# Altium project uChord Logic.PrjPcb
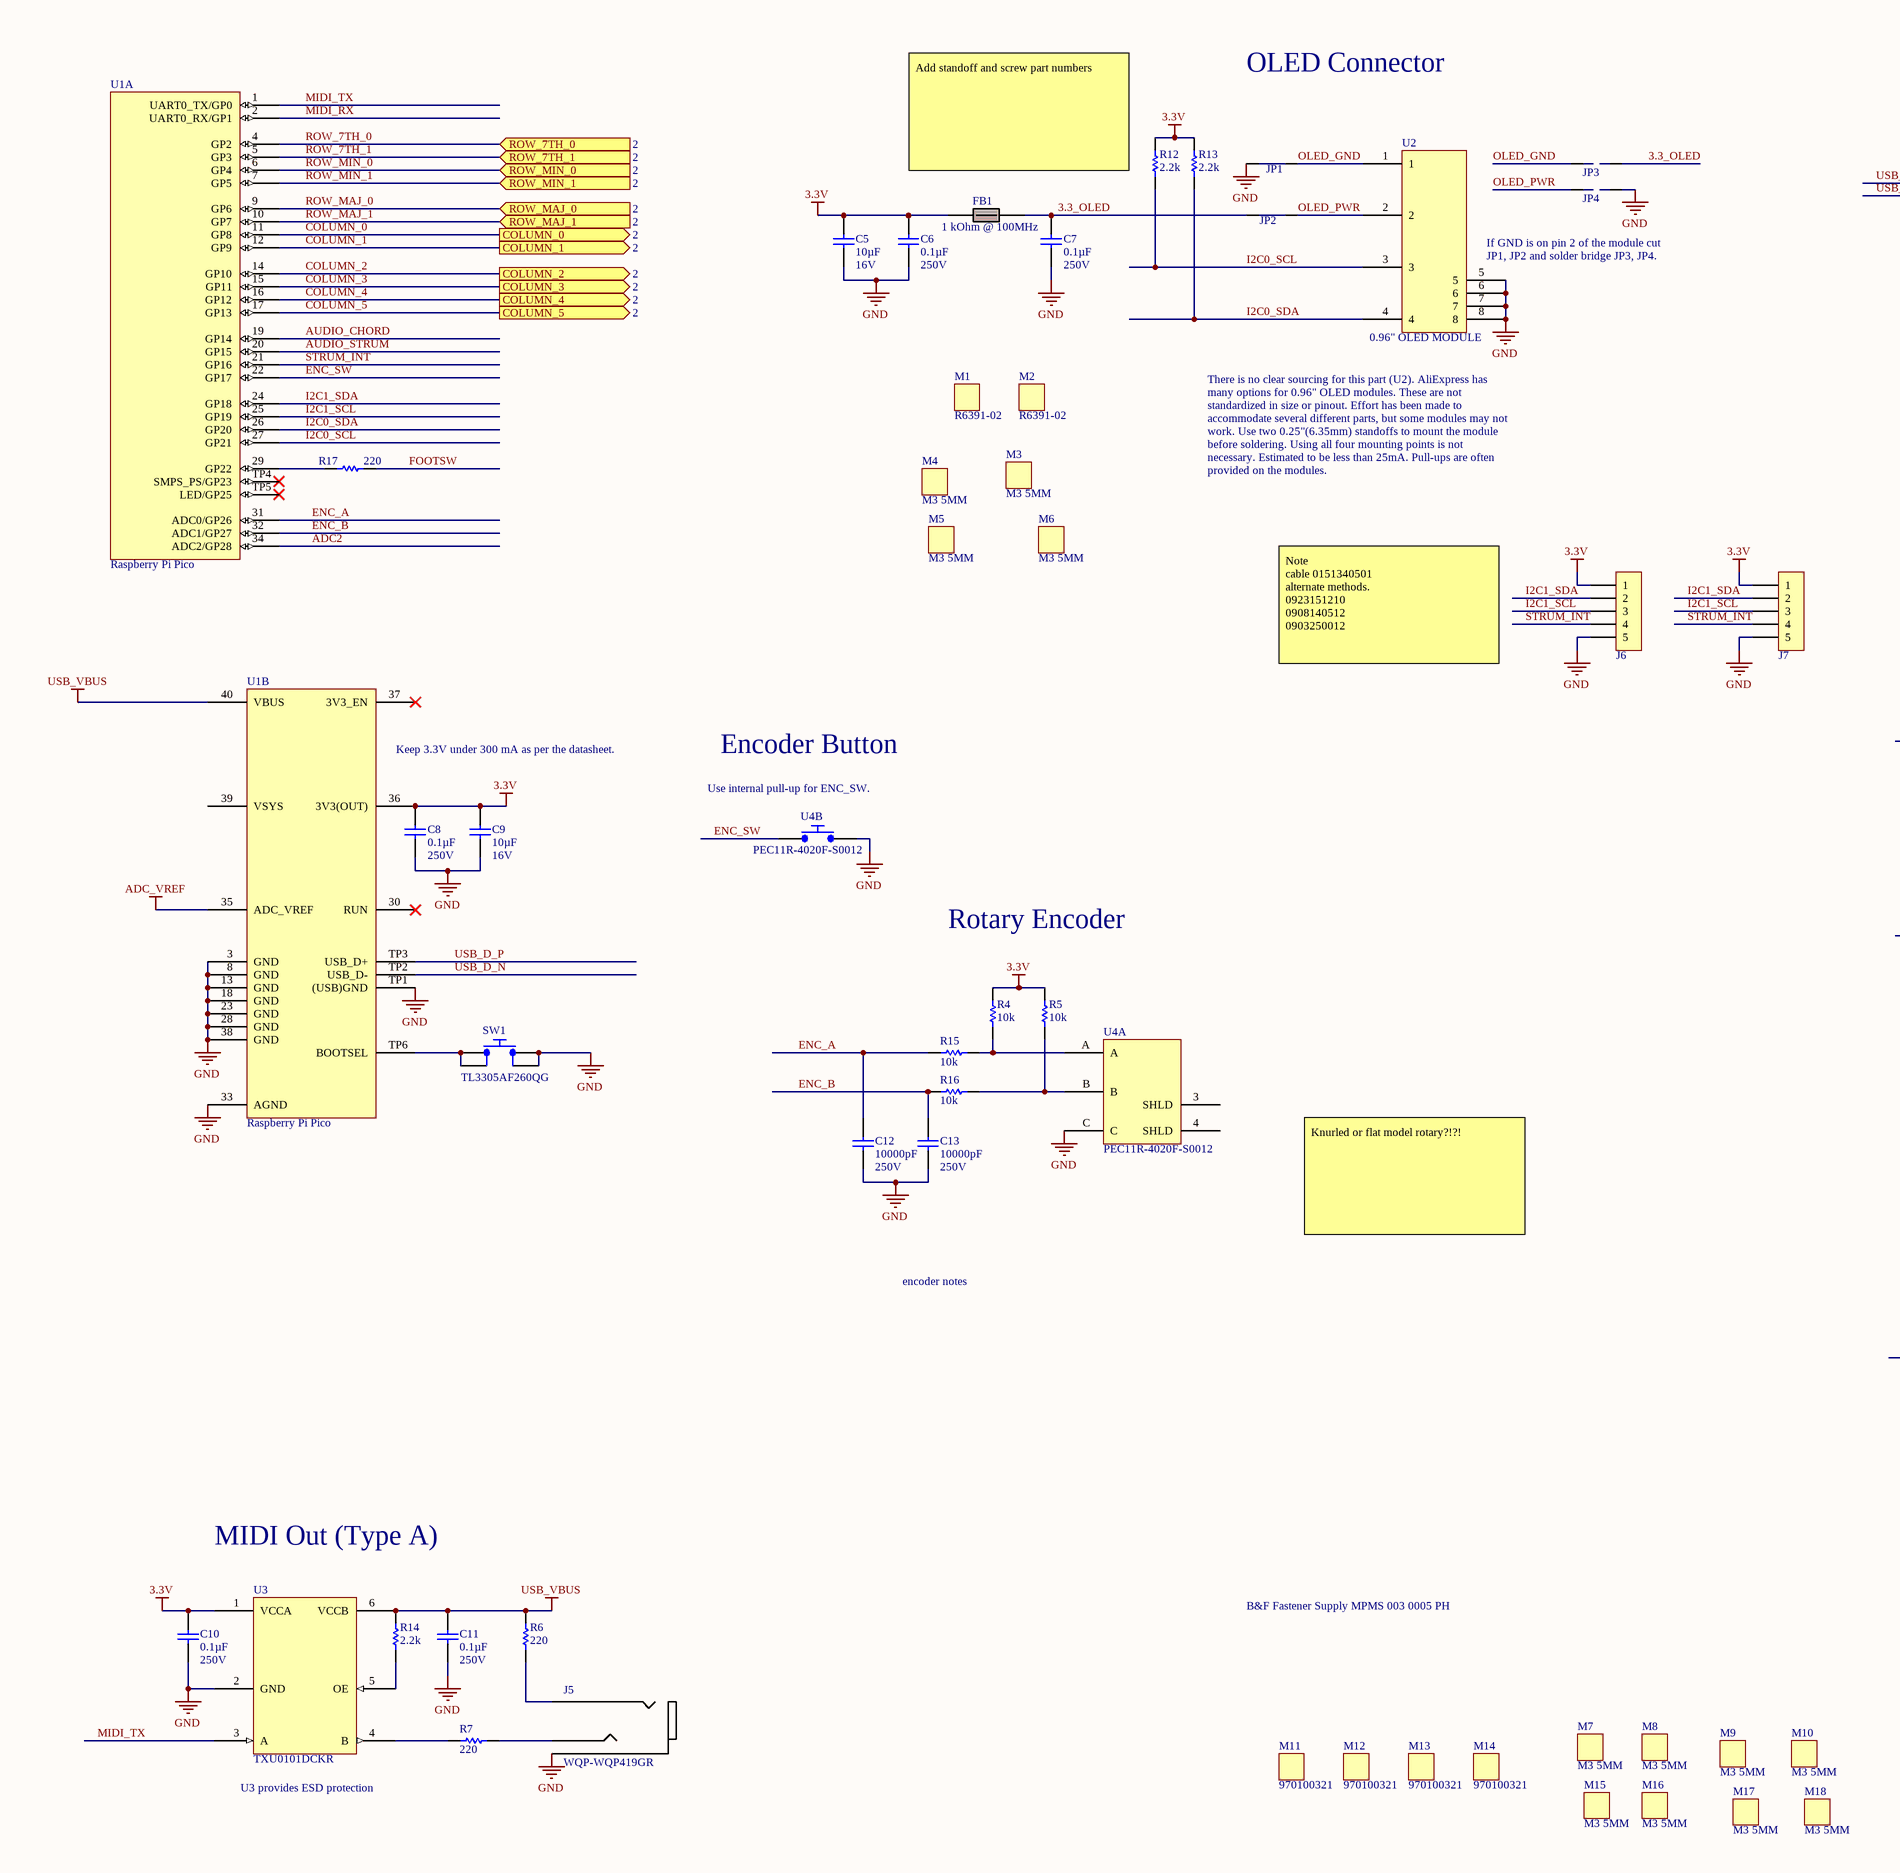
[diagram p0: Logic.SchDoc, left]
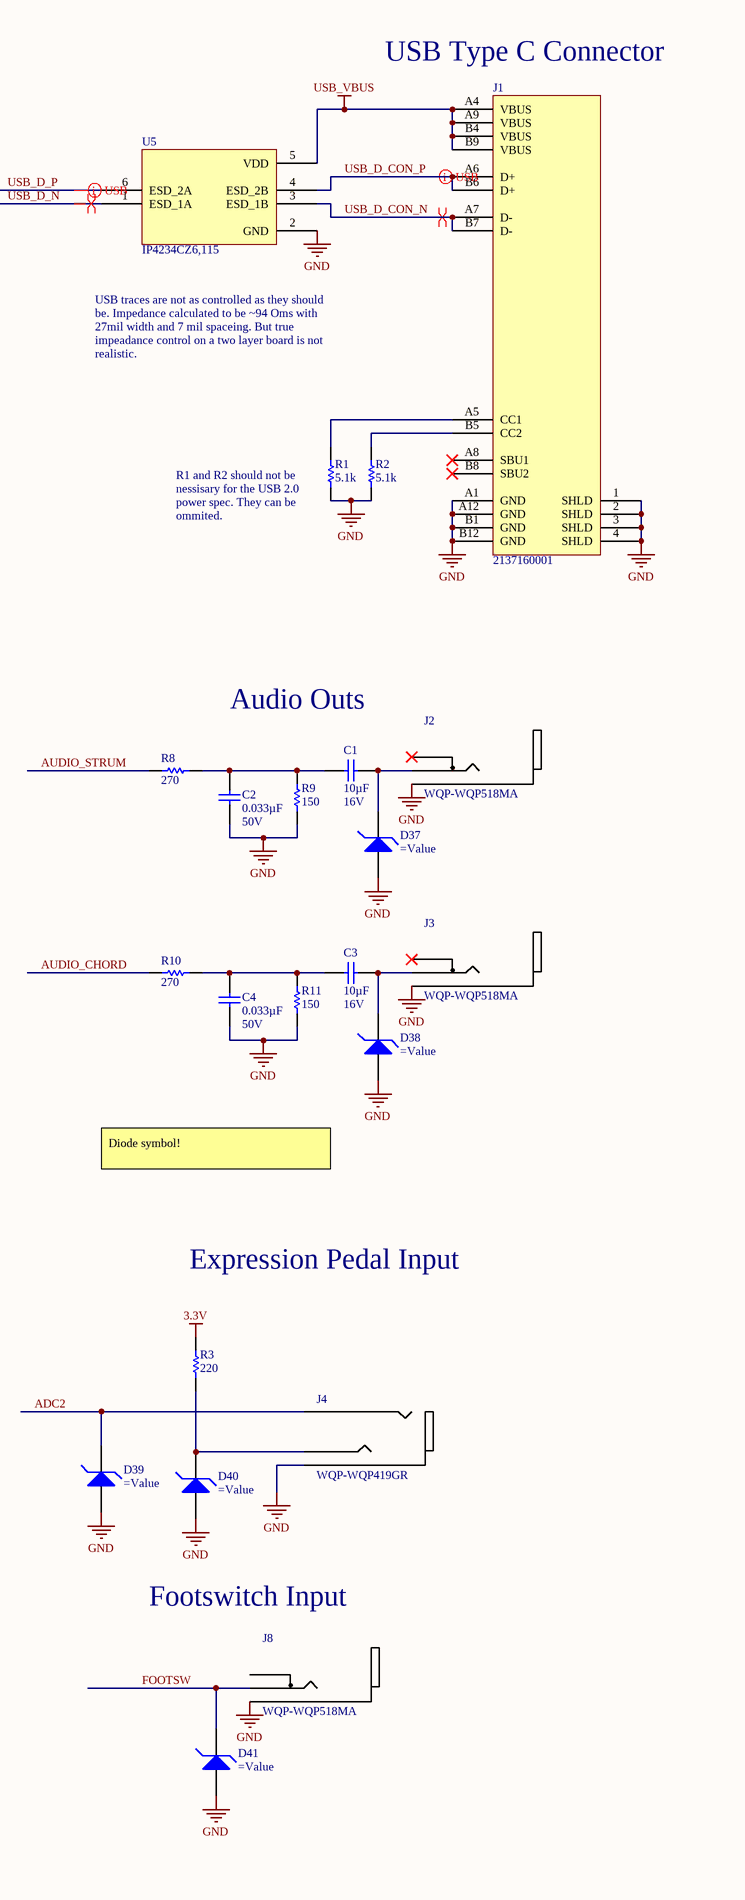
[diagram p1: Logic.SchDoc, right]
BOMRev: A; Codename: uChord Logic; HardRev: A; LeadEngineer: JCF
2 sheets, 144 parts. Net scope: flat (ports and power ports of the same name join across sheets).
Board file: uChord Logic.PcbDoc
Sheets:
  Logic.SchDoc
  Matrix.SchDoc

## Sheet Logic.SchDoc
size C; SheetNumber: 1; SheetTotal: 2

### Parts
C1  10µF  Voltage: 16V  [Chip0805]
C2  0.033µF  Voltage: 50V  [Chip0805]
C3  10µF  Voltage: 16V  [Chip0805]
C4  0.033µF  Voltage: 50V  [Chip0805]
C5  10µF  Voltage: 16V  [Chip0805]
C6  0.1µF  Voltage: 250V  [Chip0805]
C7  0.1µF  Voltage: 250V  [Chip0805]
C8  0.1µF  Voltage: 250V  [Chip0805]
C9  10µF  Voltage: 16V  [Chip0805]
C10  0.1µF  Voltage: 250V  [Chip0805]
C11  0.1µF  Voltage: 250V  [Chip0805]
C12  10000pF  Voltage: 250V  [Chip0805]
C13  10000pF  Voltage: 250V  [Chip0805]
D37  (no value)  [SOD-923]
D38  (no value)  [SOD-923]
D39  (no value)  [SOD-923]
D40  (no value)  [SOD-923]
D41  (no value)  [SOD-923]
FB1  Impedance @ Frequency: 1 kOhm @ 100MHz  [Chip0805]  (hidden comment: FERRITE)
J1  2137160001  [MOLEX_2137160001]
J2  WQP-WQP518MA  [PJ301M-12]
J3  WQP-WQP518MA  [PJ301M-12]
J4  WQP-WQP419GR  [PJ366ST]
J5  WQP-WQP419GR  [PJ366ST]
J6  0532610571  [MOLEX_0532610571]  (value not drawn)
J7  250010502  [HEADER_1x5_100mil_NP]  (value not drawn)
J8  WQP-WQP518MA  [PJ301M-12]
JP1  JUMMPER_NC_0805  [JUMMPER_NC_0805]  (value not drawn)  (no BOM)
JP2  JUMMPER_NC_0805  [JUMMPER_NC_0805]  (value not drawn)  (no BOM)
JP3  JUMMPER_NO_0805  [JUMMPER_NO_0805]  (value not drawn)  (no BOM)
JP4  JUMMPER_NO_0805  [JUMMPER_NO_0805]  (value not drawn)  (no BOM)
M1  R6391-02  (mechanical)
M2  R6391-02  (mechanical)
M3  M3 5MM  (mechanical)
M4  M3 5MM  (mechanical)
M5  M3 5MM  (mechanical)
M6  M3 5MM  (mechanical)
M7  M3 5MM  (mechanical)
M8  M3 5MM  (mechanical)
M9  M3 5MM  (mechanical)
M10  M3 5MM  (mechanical)
M11  970100321  (mechanical)
M12  970100321  (mechanical)
M13  970100321  (mechanical)
M14  970100321  (mechanical)
M15  M3 5MM  (mechanical)
M16  M3 5MM  (mechanical)
M17  M3 5MM  (mechanical)
M18  M3 5MM  (mechanical)
R1  5.1k  [Chip0603]
R2  5.1k  [Chip0603]
R3  220  [Chip0805]
R4  10k  [Chip0805]
R5  10k  [Chip0805]
R6  220  [Chip0805]
R7  220  [Chip0805]
R8  270  [Chip0805]
R9  150  [Chip0805]
R10  270  [Chip0805]
R11  150  [Chip0805]
R12  2.2k  [Chip0805]
R13  2.2k  [Chip0805]
R14  2.2k  [Chip0805]
R15  10k  [Chip0805]
R16  10k  [Chip0805]
R17  220  [Chip0805]
SW1  TL3305AF260QG  [E_SWITCH_TL3305]
U1  Raspberry Pi Pico  [RASPBERRY_PI_PICO]  (parts A,B of 2)
U2  0.96" OLED MODULE  [OLEDp96MOD_BOARD_MOUNT]
U3  TXU0101DCKR  [6-TSSOP]
U4  PEC11R-4020F-S0012  [BOURNS_PEC11R-4020F-S]  (parts A,B of 2)
U5  IP4234CZ6,115  [6-TSOP]

### Ports
COLUMN_0 (out, see 2), COLUMN_1 (out, see 2), COLUMN_2 (out, see 2), COLUMN_3 (out, see 2), COLUMN_4 (out, see 2), COLUMN_5 (out, see 2), ROW_7TH_0 (in, see 2), ROW_7TH_1 (in, see 2), ROW_MAJ_0 (in, see 2), ROW_MAJ_1 (in, see 2), ROW_MIN_0 (in, see 2), ROW_MIN_1 (in, see 2)

### Nets
3.3V: C5.2 C6.2 C8.2 C9.2 C10.2 FB1.1 J6.1 J7.1 R3.2 R4.2 R5.2 R12.2 R13.2 U1.36(3V3(OUT)) U3.1(VCCA)
ADC_VREF: U1.35(ADC_VREF)
GND: C2.1 C4.1 C5.1 C6.1 C7.1 C8.1 C9.1 C10.1 C11.1 C12.1 C13.1 D37.2(A) D38.2(A) D39.2(A) D40.2(A) D41.2(A) J1.1(SHLD) J1.2(SHLD) J1.3(SHLD) J1.4(SHLD) J1.A1(GND) J1.A12(GND) J1.B1(GND) J1.B12(GND) J2.1 J3.1 J4.1 J5.1 J6.5 J7.5 J8.1 JP1.1 JP4.1 R1.1 R2.1 R9.1 R11.1 SW1.3 SW1.4 U1.3(GND) U1.8(GND) U1.13(GND) U1.18(GND) U1.23(GND) U1.28(GND) U1.33(AGND) U1.38(GND) U1.TP1((USB)GND) U2.5 U2.6 U2.7 U2.8 U3.2(GND) U4.1 U4.C U5.2(GND)
USB_VBUS: C11.2 J1.A4(VBUS) J1.A9(VBUS) J1.B4(VBUS) J1.B9(VBUS) R6.2 R14.2 U1.40(VBUS) U3.6(VCCB) U5.5(VDD)
3.3_OLED: C7.2 FB1.2 JP2.1 JP3.1
ADC2: D39.1(K) J4.3 U1.34(ADC2/GP28)
AUDIO_CHORD: R10.1 U1.19(GP14)
AUDIO_STRUM: R8.1 U1.20(GP15)
COLUMN_0: U1.11(GP8) ; port COLUMN_0
COLUMN_1: U1.12(GP9) ; port COLUMN_1
COLUMN_2: U1.14(GP10) ; port COLUMN_2
COLUMN_3: U1.15(GP11) ; port COLUMN_3
COLUMN_4: U1.16(GP12) ; port COLUMN_4
COLUMN_5: U1.17(GP13) ; port COLUMN_5
ENC_A: C12.2 R15.2 U1.31(ADC0/GP26)
ENC_B: C13.2 R16.2 U1.32(ADC1/GP27)
ENC_SW: U1.22(GP17) U4.2
FOOTSW: D41.1(K) J8.2 R17.1
I2C0_SCL: R12.1 U1.27(GP21) U2.3
I2C0_SDA: R13.1 U1.26(GP20) U2.4
I2C1_SCL: J6.3 J7.3 U1.25(GP19)
I2C1_SDA: J6.2 J7.2 U1.24(GP18)
MIDI_RX: U1.2(UART0_RX/GP1)
MIDI_TX: U1.1(UART0_TX/GP0) U3.3(A)
OLED_GND: JP1.2 JP3.2 U2.1
OLED_PWR: JP2.2 JP4.2 U2.2
ROW_7TH_0: U1.4(GP2) ; port ROW_7TH_0
ROW_7TH_1: U1.5(GP3) ; port ROW_7TH_1
ROW_MAJ_0: U1.9(GP6) ; port ROW_MAJ_0
ROW_MAJ_1: U1.10(GP7) ; port ROW_MAJ_1
ROW_MIN_0: U1.6(GP4) ; port ROW_MIN_0
ROW_MIN_1: U1.7(GP5) ; port ROW_MIN_1
STRUM_INT: J6.4 J7.4 U1.21(GP16)
USB_D_CON_N: J1.A7(D-) J1.B7(D-) U5.3(ESD_1B)
USB_D_CON_P: J1.A6(D+) J1.B6(D+) U5.4(ESD_2B)
USB_D_N: U1.TP2(USB_D-) U5.1(ESD_1A)
USB_D_P: U1.TP3(USB_D+) U5.6(ESD_2A)
NetC1_1: C1.1 C2.2 R8.2 R9.2
NetC1_2: C1.2 D37.1(K) J2.2
NetC3_1: C3.1 C4.2 R10.2 R11.2
NetC3_2: C3.2 D38.1(K) J3.2
NetD40_1: D40.1(K) J4.2 R3.1
NetJ1_A5: J1.A5(CC1) R1.2
NetJ1_B5: J1.B5(CC2) R2.2
NetJ5_2: J5.2 R7.2
NetJ5_3: J5.3 R6.1
NetR4_1: R4.1 R15.1 U4.A
NetR5_1: R5.1 R16.1 U4.B
NetR7_1: R7.1 U3.4(B)
NetR14_1: R14.1 U3.5(OE)
NetR17_2: R17.2 U1.29(GP22)
NetSW1_1: SW1.1 SW1.2 U1.TP6(BOOTSEL)

Not connected (* = marked no-connect by the designer): J1 A8(SBU1)* B8(SBU2)*; J2 3*; J3 3*; J8 3; U1 30(RUN)* 37(3V3_EN)* 39(VSYS) TP4(SMPS_PS/GP23)* TP5(LED/GP25)*; U4 3(SHLD) 4(SHLD)

### Layout directives
differential pair; differential pair class DIFF90: USB_D_CON_N, USB_D_CON_P, USB_D_N, USB_D_P

### Notes on the sheet
- OLED Connector
- (near J1) USB Type C Connector
- (near R12) Add standoff and screw part numbers
- (near U2) If GND is on pin 2 of the module cut JP1, JP2 and solder bridge JP3, JP4.
- USB traces are not as controlled as they should be. Impedance calculated to be ~94 Oms with 27mil width and 7 mil spaceing. But true impeadance control on a two layer board is not realistic.
- There is no clear sourcing for this part (U2). AliExpress has many options for 0.96" OLED modules. These are not standardized in size or pinout. Effort has been made to accommodate several different parts, but some modules may not work. Use two 0.25"(6.35mm) standoffs to mount the module before soldering. Using all four mounting points is not necessary. Estimated to be less than 25mA. Pull-ups are often provided on the modules.
- (near R1) R1 and R2 should not be nessisary for the USB 2.0 power spec. They can be ommited.
- Note
  cable 0151340501
  alternate methods.
  0923151210
  0908140512
  0903250012
- Audio Outs
- (near U1) Keep 3.3V under 300 mA as per the datasheet.
- Encoder Button
- (near U4) Use internal pull-up for ENC_SW.
- Rotary Encoder
- Diode symbol!
- Knurled or flat model rotary?!?!
- Expression Pedal Input
- encoder notes
- MIDI Out (Type A)
- Footswitch Input
- B&F Fastener Supply MPMS 003 0005 PH
- U3 provides ESD protection
- Title:
- This work is licensed under a Creative Commons Attribution 4.0 International License. Derivative works should remove all Sophistry branding and ‘é’ watermark.
- Date:
- Engineer:
- Revision:
- Codename:
- Time:
- Variant:
- Sheet
- of

### Library data of the parts
C1 C3 C5 C9 = C2012X5R1C106K125AC: CAP CER 10UF 16V 10% X5R 0805; Manufacturer: TDK Corporation; PartNumber: C2012X5R1C106K125AC; HelpURL: http://product.tdk.com/capacitor/mlcc/en/documents/mlcc_commercial_general_en.pdf; Supplier 1: Digi-Key; Supplier Part Number 1: 445-7646-1-ND; Supplier 2: Mouser; Manufacturer Part Number: C2012X5R1C106K125AC; Series: C; Capacitance: 10µF; Tolerance: ±10%; Temperature Coefficient: X5R; Mounting Type: Surface Mount, MLCC; Operating Temperature: -55°C ~ 85°C; Applications: General Purpose; Ratings: -; Package / Case: 0805 (2012 Metric); Size / Dimension: 0.079" L x 0.049" W (2.00mm x 1.25mm); Height - Seated (Max): -; Thickness (Max): 0.057" (1.45mm); Lead Spacing: -; Features: -; Lead Style: -
C2 C4 = C2012C0G1H333J125AA: CAP CER 0.033UF 50V 5% NP0 0805; Manufacturer: TDK Corporation; Temperature Coefficient: C0G, NP0; PartNumber: C2012C0G1H333J125AA; HelpURL: http://product.tdk.com/capacitor/mlcc/en/documents/mlcc_commercial_general_en.pdf; Supplier 1: Digi-Key; Supplier Part Number 1: 445-7523-1-ND; Supplier 2: Mouser; Manufacturer Part Number: C2012C0G1H333J125AA; Series: C; Capacitance: 0.033µF; Tolerance: ±5%; Mounting Type: Surface Mount, MLCC; Operating Temperature: -55°C ~ 125°C; Applications: General Purpose; Ratings: -; Package / Case: 0805 (2012 Metric); Size / Dimension: 0.079" L x 0.049" W (2.00mm x 1.25mm); Height - Seated (Max): -; Thickness (Max): 0.057" (1.45mm); Lead Spacing: -; Features: -; Lead Style: -
C6-C8 C10 C11 = C2012X7T2E104K125AA: CAP CER 0.1UF 250V 10% X7T 0805; Manufacturer: TDK Corporation; PartNumber: C2012X7T2E104K125AA; HelpURL: http://product.tdk.com/capacitor/mlcc/en/documents/mlcc_commercial_midvoltage_en.pdf; Supplier 1: Digi-Key; Supplier Part Number 1: 445-7749-1-ND; Supplier 2: Mouser; Manufacturer Part Number: C2012X7T2E104K125AA; Series: C; Capacitance: 0.1µF; Tolerance: ±10%; Temperature Coefficient: X7T; Mounting Type: Surface Mount, MLCC; Operating Temperature: -55°C ~ 125°C; Applications: General Purpose; Ratings: -; Package / Case: 0805 (2012 Metric); Size / Dimension: 0.079" L x 0.049" W (2.00mm x 1.25mm); Height - Seated (Max): -; Thickness (Max): 0.057" (1.45mm); Lead Spacing: -; Features: -; Lead Style: -
C12 C13 = C2012X7R2E103M125AE: CAP CER 10000PF 250V X7R 0805; Manufacturer: TDK Corporation; Tolerance: ±20%; PartNumber: C2012X7R2E103M125AE; HelpURL: http://product.tdk.com/capacitor/mlcc/en/documents/mlcc_commercial_soft_en.pdf; Supplier 1: Digi-Key; Supplier Part Number 1: 445-6805-1-ND; Supplier 2: Mouser; Manufacturer Part Number: C2012X7R2E103M125AE; Series: C; Capacitance: 10000pF; Temperature Coefficient: X7R; Mounting Type: Surface Mount, MLCC; Operating Temperature: -55°C ~ 125°C; Applications: Boardflex Sensitive; Ratings: -; Package / Case: 0805 (2012 Metric); Size / Dimension: 0.079" L x 0.049" W (2.00mm x 1.25mm); Height - Seated (Max): -; Thickness (Max): 0.057" (1.45mm); Lead Spacing: -; Features: Soft Termination; Lead Style: -
D37-D41 = SZESD9X3.3ST5G: TVS DIODE 3.3VWM 10.4VC SOD923; Manufacturer: onsemi; PartNumber: SZESD9X3.3ST5G; Supplier 1: Digi-Key; Supplier 2: Mouser; Supplier Part Number 2: 863-SZESD9X3.3ST5G; HelpURL: https://www.onsemi.com/pdf/datasheet/esd9x3.3st5g-d.pdf; Supplier Part Number 1: SZESD9X3.3ST5GOSCT-ND; Manufacturer Part Number: SZESD9X3.3ST5G
FB1 = 74279205: FERRITE BEAD 1000 OHM .20A 0805; Manufacturer: Wurth Electronics Inc; Current Rating: 200mA; DC Resistance (DCR): 450 mOhm Max; Filter Type: Differential Mode - Single; PartNumber: 74279205; HelpURL: http://katalog.we-online.de/pbs/datasheet/74279205.pdf; Supplier 1: Digi-Key; Supplier Part Number 1: 732-1606-1-ND; Manufacturer Part Number: 74279205; Series: WE-CBF; Package / Case: 0805 (2012 Metric); Mounting Type: Surface Mount; Height (Max): 0.043" (1.10mm); Size / Dimension: 0.079" L x 0.047" W (2.00mm x 1.20mm)
J1 = 2137160001: CONN RCPT USB2.0 TYPE C 24POS RA; Manufacturer: Molex, LLC; PartNumber: 2137160001; Supplier 1: Digi-Key; Supplier 2: Mouser; Supplier Part Number 2: 538-213716-0001; HelpURL: https://www.molex.com/pdm_docs/sd/2137160001_sd.pdf; Supplier Part Number 1: 900-2137160001CT-ND; Manufacturer Part Number: 2137160001
J2 J3 J8 = WQP-WQP518MA: CONN 3.5mm VIRTICAL MONO w/ NORMAL; Manufacturer: QingPu; Connector Type: Phone Jack; Gender: Female; PartNumber: WQP-WQP518MA; HelpURL: http://www.qingpu-electronics.com/en/products/WQP-PJ398SM-362.html; Supplier 1: QingPu; Supplier Part Number 1: WQP-WQP518MA; Manufacturer Part Number: WQP-WQP518MA; Signal Lines: Mono
J4 J5 = WQP-WQP419GR: CONN 3.5mm VIRTICAL STEREO; Manufacturer: QingPu; Connector Type: Phone Jack; Gender: Female; PartNumber: WQP-WQP419GR; HelpURL: http://www.qingpu-electronics.com/en/products/WQP-PJ366ST-364.html; Supplier 1: QingPu; Supplier Part Number 1: WQP-WQP419GR; Manufacturer Part Number: WQP-WQP419GR; Signal Lines: Stereo
J6 = 0532610571: CONN HEADER SMD R/A 5POS 1.25MM; Manufacturer Part Number: WM7623CT-ND; Manufacturer: Molex; PartNumber: 0532610571; Supplier 1: Digi-Key; Supplier 2: Mouser; HelpURL: https://www.molex.com/pdm_docs/sd/532610571_sd.pdf
J7 = 250010502: CABLE 5POS .100 JUMPER 2 INCHES; Manufacturer: Molex Inc; Cable Type: Ribbon; Number of Conductors: 5; Pitch: 0.100" (2.54mm); PartNumber: 250010502; Datasheets: http://www.molex.com/pdm_docs/sd/250010502_sd.pdf; Supplier 1: Digi-Key; Supplier Part Number 1: WM05-02A-ND; Supplier 2: Mouser; Supplier Part Number 2: 538-25001-0502; Manufacturer Part Number: 250010502; Series: 25001; Length: 2.00" (50.80mm); Length - Exposed Ends: 0.125" (3.18mm); Termination Style: Completely Exposed Wires on Both Sides with Protective Tab
M1 M2 = R6391-02: HEX STANDOFF M3X0.5 BRASS 1/4"; Manufacturer: Harwin Inc.; HelpURL: https://cdn.harwin.com/pdfs/R6390-R6397.pdf; Supplier 1: Digi-Key; Supplier Part Number 1: R6391-02-ND; Supplier 2: Mouser; Supplier Part Number 2: 855-R6391-02; PartNumber: R6391-02; Manufacturer Part Number: R6391-02
M3-M10 M15-M18 = M3 5MM: MACH SCREW PAN HEAD PHILLIPS M3 5MM; Supplier 1: Digi-Key; Supplier 2: Mouser; PartNumber: M3 5MM; Manufacturer Part Number: M3 5MM
M11-M14 = 970100321: HEX STANDOFF M3X0.5 STEEL 10MM; Manufacturer: Würth Elektronik; HelpURL: https://www.we-online.com/katalog/datasheet/970xxxxx1_overview.pdf; Supplier 1: Digi-Key; Supplier Part Number 1: 732-10541-ND; Supplier 2: Mouser; Supplier Part Number 2: 710-970100321; PartNumber: 970100321; Manufacturer Part Number: 970100321
R1 R2 = CRCW06035K10FKEA: RES 5.10K OHM 1/10W 1% 0603 SMD; Manufacturer: Vishay Dale; Power (Watts): 0.1W, 1/10W; Temperature Coefficient: ±100ppm/°C; PartNumber: CRCW06035K10FKEA; HelpURL: http://www.vishay.com/doc?20035; Supplier 1: Digi-Key; Supplier Part Number 1: 541-5.10KHCT-ND; Supplier 2: Mouser; Supplier Part Number 2: 71-CRCW0603-5.1K-E3; Manufacturer Part Number: CRCW06035K10FKEA; Series: CRCW; Resistance: 5.1k; Tolerance: ±1%; Composition: Thick Film; Features: Automotive AEC-Q200 Qualified; Package / Case: 0603 (1608 Metric); Supplier Device Package: 0603 (1608 Metric); Size / Dimension: 0.061" L x 0.033" W (1.55mm x 0.85mm); Height: 0.020" (0.50mm); Number of Terminations: 2
R3 R6 R7 R17 = CRCW0805220RFKEA: RES 220 OHM 1/8W 1% 0805 SMD; Manufacturer: Vishay Dale; Power (Watts): 0.125W, 1/8W; Temperature Coefficient: ±100ppm/°C; PartNumber: CRCW0805220RFKEA; HelpURL: http://www.vishay.com/doc?20035; Supplier 1: Digi-Key; Supplier Part Number 1: 541-220CCT-ND; Supplier 2: Mouser; Manufacturer Part Number: CRCW0805220RFKEA; Series: CRCW; Resistance: 220; Tolerance: ±1%; Composition: Thick Film; Features: Automotive AEC-Q200 Qualified; Package / Case: 0805 (2012 Metric); Supplier Device Package: 0805 (2012 Metric); Size / Dimension: 0.079" L x 0.049" W (2.00mm x 1.25mm); Height: 0.020" (0.50mm); Number of Terminations: 2
R4 R5 R15 R16 = CRCW080510K0FKEA: RES 10.0K OHM 1/8W 1% 0805 SMD; Manufacturer: Vishay Dale; Power (Watts): 0.125W, 1/8W; Temperature Coefficient: ±100ppm/°C; PartNumber: CRCW080510K0FKEA; HelpURL: http://www.vishay.com/doc?20035; Supplier 1: Digi-Key; Supplier Part Number 1: 541-10.0KCCT-ND; Supplier 2: Mouser; Manufacturer Part Number: CRCW080510K0FKEA; Series: CRCW; Resistance: 10k; Tolerance: ±1%; Composition: Thick Film; Features: Automotive AEC-Q200 Qualified; Package / Case: 0805 (2012 Metric); Supplier Device Package: 0805 (2012 Metric); Size / Dimension: 0.079" L x 0.049" W (2.00mm x 1.25mm); Height: 0.020" (0.50mm); Number of Terminations: 2
R8 R10 = CRCW0805270RFKEA: RES 270 OHM 1/8W 1% 0805 SMD; Manufacturer: Vishay Dale; Power (Watts): 0.125W, 1/8W; Temperature Coefficient: ±100ppm/°C; PartNumber: CRCW0805270RFKEA; HelpURL: http://www.vishay.com/doc?20035; Supplier 1: Digi-Key; Supplier Part Number 1: 541-270CCT-ND; Supplier 2: Mouser; Manufacturer Part Number: CRCW0805270RFKEA; Series: CRCW; Resistance: 270; Tolerance: ±1%; Composition: Thick Film; Features: Automotive AEC-Q200 Qualified; Package / Case: 0805 (2012 Metric); Supplier Device Package: 0805 (2012 Metric); Size / Dimension: 0.079" L x 0.049" W (2.00mm x 1.25mm); Height: 0.020" (0.50mm); Number of Terminations: 2
R9 R11 = CRCW0805150RFKEA: RES 150 OHM 1/8W 1% 0805 SMD; Manufacturer: Vishay Dale; Power (Watts): 0.125W, 1/8W; Temperature Coefficient: ±100ppm/°C; PartNumber: CRCW0805150RFKEA; HelpURL: http://www.vishay.com/doc?20035; Supplier 1: Digi-Key; Supplier Part Number 1: 541-150CCT-ND; Supplier 2: Mouser; Manufacturer Part Number: CRCW0805150RFKEA; Series: CRCW; Resistance: 150; Tolerance: ±1%; Composition: Thick Film; Features: Automotive AEC-Q200 Qualified; Package / Case: 0805 (2012 Metric); Supplier Device Package: 0805 (2012 Metric); Size / Dimension: 0.079" L x 0.049" W (2.00mm x 1.25mm); Height: 0.020" (0.50mm); Number of Terminations: 2
R12-R14 = CRCW08052K20FKEA: RES 2.20K OHM 1/8W 1% 0805 SMD; Manufacturer: Vishay Dale; Power (Watts): 0.125W, 1/8W; Temperature Coefficient: ±100ppm/°C; PartNumber: CRCW08052K20FKEA; HelpURL: http://www.vishay.com/doc?20035; Supplier 1: Digi-Key; Supplier Part Number 1: 541-2.20KCCT-ND; Supplier 2: Mouser; Manufacturer Part Number: CRCW08052K20FKEA; Series: CRCW; Resistance: 2.2k; Tolerance: ±1%; Composition: Thick Film; Features: Automotive AEC-Q200 Qualified; Package / Case: 0805 (2012 Metric); Supplier Device Package: 0805 (2012 Metric); Size / Dimension: 0.079" L x 0.049" W (2.00mm x 1.25mm); Height: 0.020" (0.50mm); Number of Terminations: 2
SW1 = TL3305AF260QG: SWITCH TACTILE SPST-NO 50MA 12V; Manufacturer: E-Switch; PartNumber: TL3305AF260QG; HelpURL: https://sten-eswitch-13110800-production.s3.amazonaws.com/system/asset/product_line/data_sheet/213/TL3305.pdf; Supplier 1: Digi-Key; Supplier Part Number 1: EG5353TR-ND; Supplier 2: Mouser; Supplier Part Number 2: 612-TL3305AF260QG; Manufacturer Part Number: TL3305AF260QG
U1 = Raspberry Pi Pico: RASPBERRY PI PICO RP2040 BOARD; Manufacturer Part Number: SC0915; PartNumber: Raspberry Pi Pico; Supplier 1: Digi-Key; Supplier Part Number 1: 2648-SC0915CT-ND; Manufacturer: Raspberry Pi
U2 = 0.96" OLED MODULE: 0.96" I2C OLED MODULE; PartNumber: 0.96" OLED MODULE
U3 = TXU0101DCKR: SINGLE CHANNEL FIXED-DIRECTION L; Manufacturer: Texas Instruments; PartNumber: TXU0101DCKR; Supplier 1: Digi-Key; Supplier 2: Mouser; Supplier Part Number 1: 296-TXU0101DCKRCT-ND; Supplier Part Number 2: 595-TXU0101DCKR; HelpURL: https://www.ti.com/lit/ds/symlink/txu0101.pdf; Manufacturer Part Number: TXU0101DCKR
U4 = PEC11R-4020F-S0012: ROTARY ENCODER MECHANICAL 12PPR; Manufacturer: Bourns Inc.; PartNumber: PEC11R-4020F-S0012; Datasheets: https://www.bourns.com/docs/Product-Datasheets/PEC11R.pdf; Supplier 1: Digi-Key; Supplier 2: Mouser; Supplier Part Number 1: PEC11R-4020F-S0012-ND; Supplier Part Number 2: 652-PEC11R-4020F-S12; Manufacturer Part Number: PEC11R-4020F-S0012
U5 = IP4234CZ6,115: TVS DIODE 5.5VWM 6TSOP; Manufacturer: Nexperia USA Inc.; PartNumber: IP4234CZ6,115; Supplier 1: Digi-Key; Supplier 2: Mouser; Supplier Part Number 2: 771-IP4234CZ6; HelpURL: https://assets.nexperia.com/documents/data-sheet/IP4234CZ6.pdf; Supplier Part Number 1: 1727-1217-1-ND; Manufacturer Part Number: IP4234CZ6,115
JP1 JP2 = JUMMPER_NC_0805: PartNumber: JUMMPER_NC_0805; Manufacturer Part Number: JUMMPER_NC_0805
JP3 JP4 = JUMMPER_NO_0805: PartNumber: JUMMPER_NO_0805; Manufacturer Part Number: JUMMPER_NO_0805

## Sheet Matrix.SchDoc
size C; SheetNumber: 2; SheetTotal: 2
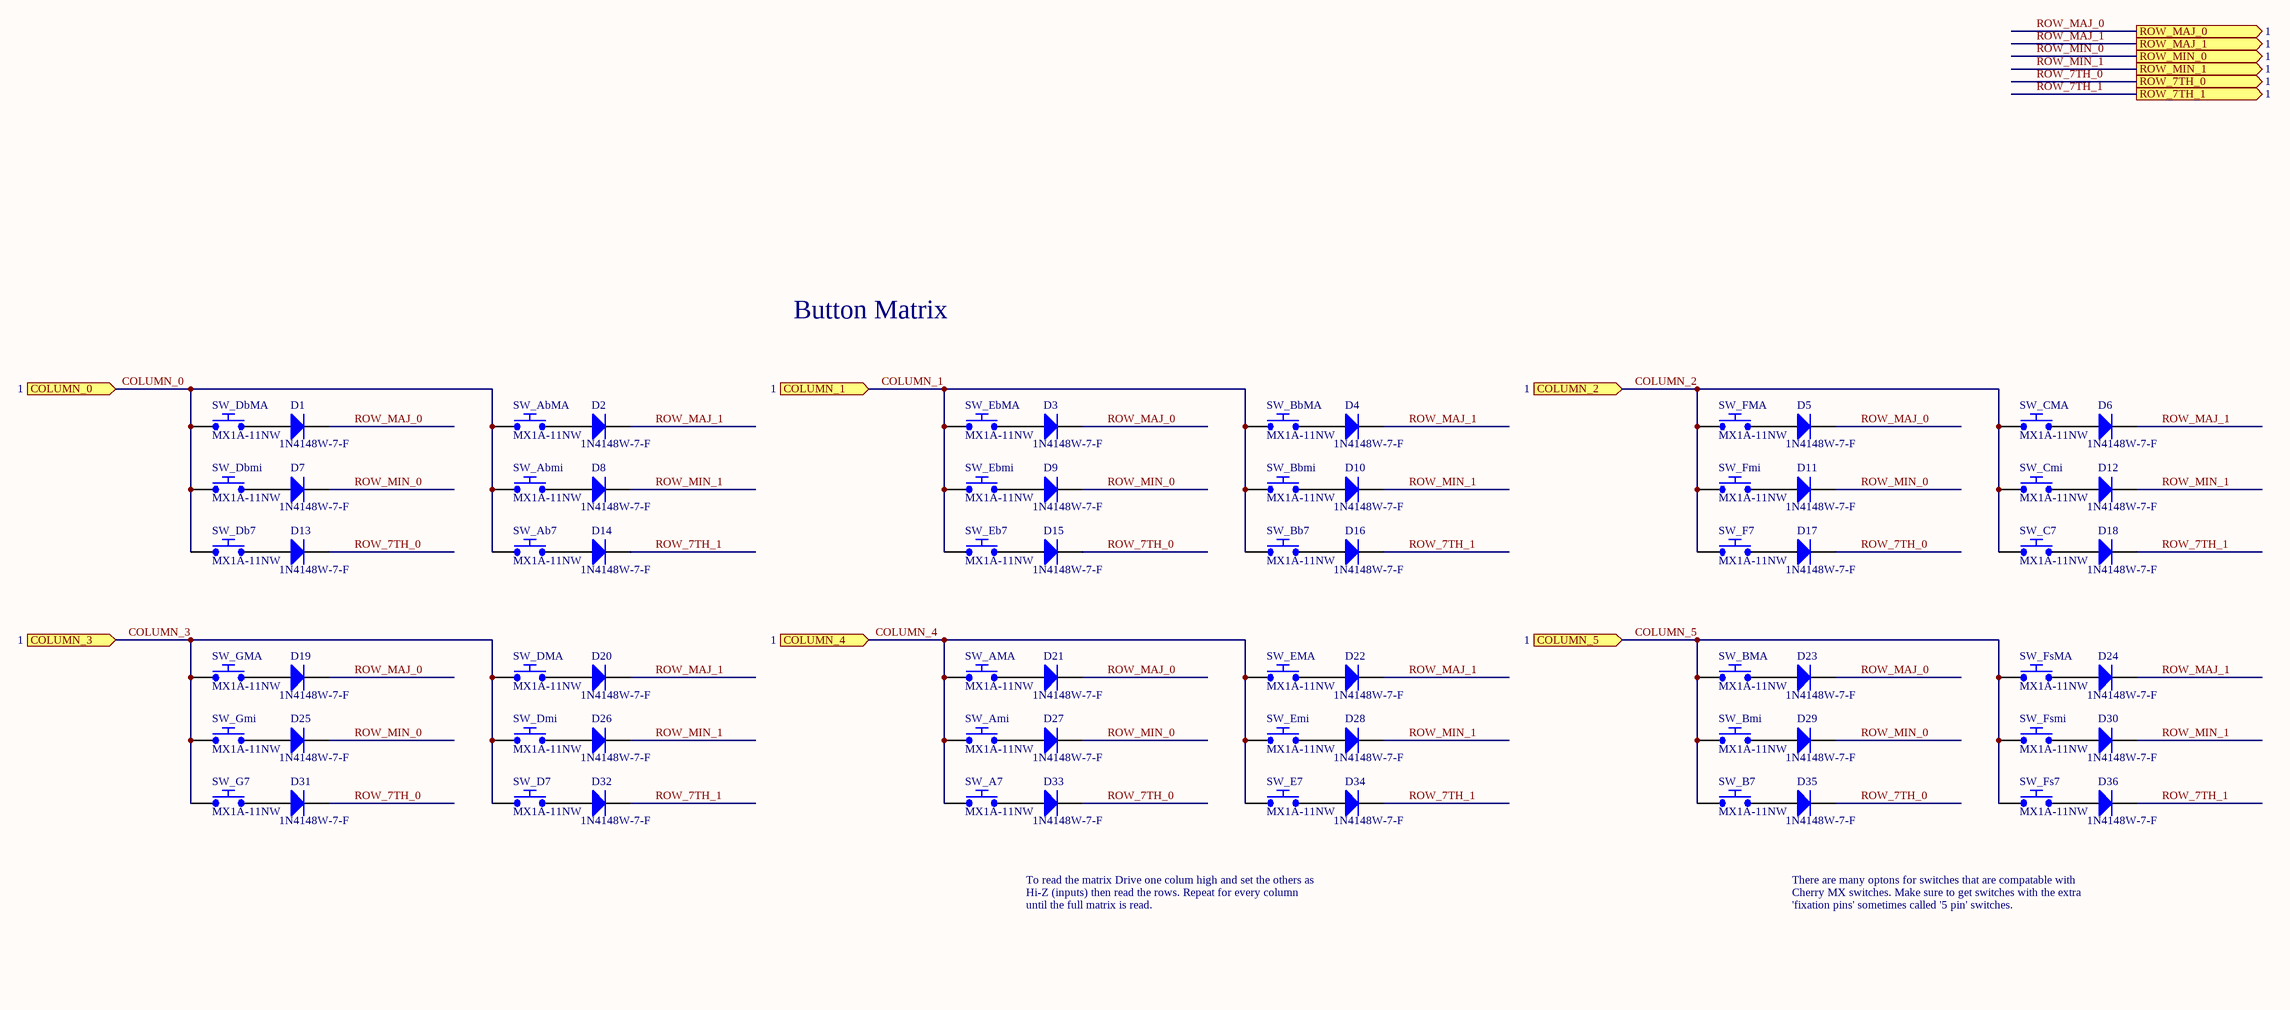
[diagram p2: Matrix.SchDoc]

### Parts
D1  1N4148W-7-F  [SOD-123]
D2  1N4148W-7-F  [SOD-123]
D3  1N4148W-7-F  [SOD-123]
D4  1N4148W-7-F  [SOD-123]
D5  1N4148W-7-F  [SOD-123]
D6  1N4148W-7-F  [SOD-123]
D7  1N4148W-7-F  [SOD-123]
D8  1N4148W-7-F  [SOD-123]
D9  1N4148W-7-F  [SOD-123]
D10  1N4148W-7-F  [SOD-123]
D11  1N4148W-7-F  [SOD-123]
D12  1N4148W-7-F  [SOD-123]
D13  1N4148W-7-F  [SOD-123]
D14  1N4148W-7-F  [SOD-123]
D15  1N4148W-7-F  [SOD-123]
D16  1N4148W-7-F  [SOD-123]
D17  1N4148W-7-F  [SOD-123]
D18  1N4148W-7-F  [SOD-123]
D19  1N4148W-7-F  [SOD-123]
D20  1N4148W-7-F  [SOD-123]
D21  1N4148W-7-F  [SOD-123]
D22  1N4148W-7-F  [SOD-123]
D23  1N4148W-7-F  [SOD-123]
D24  1N4148W-7-F  [SOD-123]
D25  1N4148W-7-F  [SOD-123]
D26  1N4148W-7-F  [SOD-123]
D27  1N4148W-7-F  [SOD-123]
D28  1N4148W-7-F  [SOD-123]
D29  1N4148W-7-F  [SOD-123]
D30  1N4148W-7-F  [SOD-123]
D31  1N4148W-7-F  [SOD-123]
D32  1N4148W-7-F  [SOD-123]
D33  1N4148W-7-F  [SOD-123]
D34  1N4148W-7-F  [SOD-123]
D35  1N4148W-7-F  [SOD-123]
D36  1N4148W-7-F  [SOD-123]
SW_A7  MX1A-11NW  [CHERRY_MX_FIX]
SW_Ab7  MX1A-11NW  [CHERRY_MX_FIX]
SW_AbMA  MX1A-11NW  [CHERRY_MX_FIX]
SW_Abmi  MX1A-11NW  [CHERRY_MX_FIX]
SW_AMA  MX1A-11NW  [CHERRY_MX_FIX]
SW_Ami  MX1A-11NW  [CHERRY_MX_FIX]
SW_B7  MX1A-11NW  [CHERRY_MX_FIX]
SW_Bb7  MX1A-11NW  [CHERRY_MX_FIX]
SW_BbMA  MX1A-11NW  [CHERRY_MX_FIX]
SW_Bbmi  MX1A-11NW  [CHERRY_MX_FIX]
SW_BMA  MX1A-11NW  [CHERRY_MX_FIX]
SW_Bmi  MX1A-11NW  [CHERRY_MX_FIX]
SW_C7  MX1A-11NW  [CHERRY_MX_FIX]
SW_CMA  MX1A-11NW  [CHERRY_MX_FIX]
SW_Cmi  MX1A-11NW  [CHERRY_MX_FIX]
SW_D7  MX1A-11NW  [CHERRY_MX_FIX]
SW_Db7  MX1A-11NW  [CHERRY_MX_FIX]
SW_DbMA  MX1A-11NW  [CHERRY_MX_FIX]
SW_Dbmi  MX1A-11NW  [CHERRY_MX_FIX]
SW_DMA  MX1A-11NW  [CHERRY_MX_FIX]
SW_Dmi  MX1A-11NW  [CHERRY_MX_FIX]
SW_E7  MX1A-11NW  [CHERRY_MX_FIX]
SW_Eb7  MX1A-11NW  [CHERRY_MX_FIX]
SW_EbMA  MX1A-11NW  [CHERRY_MX_FIX]
SW_Ebmi  MX1A-11NW  [CHERRY_MX_FIX]
SW_EMA  MX1A-11NW  [CHERRY_MX_FIX]
SW_Emi  MX1A-11NW  [CHERRY_MX_FIX]
SW_F7  MX1A-11NW  [CHERRY_MX_FIX]
SW_FMA  MX1A-11NW  [CHERRY_MX_FIX]
SW_Fmi  MX1A-11NW  [CHERRY_MX_FIX]
SW_Fs7  MX1A-11NW  [CHERRY_MX_FIX]
SW_FsMA  MX1A-11NW  [CHERRY_MX_FIX]
SW_Fsmi  MX1A-11NW  [CHERRY_MX_FIX]
SW_G7  MX1A-11NW  [CHERRY_MX_FIX]
SW_GMA  MX1A-11NW  [CHERRY_MX_FIX]
SW_Gmi  MX1A-11NW  [CHERRY_MX_FIX]

### Ports
COLUMN_0 (in, see 1), COLUMN_1 (in, see 1), COLUMN_2 (in, see 1), COLUMN_3 (in, see 1), COLUMN_4 (in, see 1), COLUMN_5 (in, see 1), ROW_7TH_0 (out, see 1), ROW_7TH_1 (out, see 1), ROW_MAJ_0 (out, see 1), ROW_MAJ_1 (out, see 1), ROW_MIN_0 (out, see 1), ROW_MIN_1 (out, see 1)

### Nets
COLUMN_0: SW_Ab7.1 SW_AbMA.1 SW_Abmi.1 SW_Db7.1 SW_DbMA.1 SW_Dbmi.1 ; port COLUMN_0
COLUMN_1: SW_Bb7.1 SW_BbMA.1 SW_Bbmi.1 SW_Eb7.1 SW_EbMA.1 SW_Ebmi.1 ; port COLUMN_1
COLUMN_2: SW_C7.1 SW_CMA.1 SW_Cmi.1 SW_F7.1 SW_FMA.1 SW_Fmi.1 ; port COLUMN_2
COLUMN_3: SW_D7.1 SW_DMA.1 SW_Dmi.1 SW_G7.1 SW_GMA.1 SW_Gmi.1 ; port COLUMN_3
COLUMN_4: SW_A7.1 SW_AMA.1 SW_Ami.1 SW_E7.1 SW_EMA.1 SW_Emi.1 ; port COLUMN_4
COLUMN_5: SW_B7.1 SW_BMA.1 SW_Bmi.1 SW_Fs7.1 SW_FsMA.1 SW_Fsmi.1 ; port COLUMN_5
ROW_7TH_0: D13.1(C) D15.1(C) D17.1(C) D31.1(C) D33.1(C) D35.1(C) ; port ROW_7TH_0
ROW_7TH_1: D14.1(C) D16.1(C) D18.1(C) D32.1(C) D34.1(C) D36.1(C) ; port ROW_7TH_1
ROW_MAJ_0: D1.1(C) D3.1(C) D5.1(C) D19.1(C) D21.1(C) D23.1(C) ; port ROW_MAJ_0
ROW_MAJ_1: D2.1(C) D4.1(C) D6.1(C) D20.1(C) D22.1(C) D24.1(C) ; port ROW_MAJ_1
ROW_MIN_0: D7.1(C) D9.1(C) D11.1(C) D25.1(C) D27.1(C) D29.1(C) ; port ROW_MIN_0
ROW_MIN_1: D8.1(C) D10.1(C) D12.1(C) D26.1(C) D28.1(C) D30.1(C) ; port ROW_MIN_1
NetD1_2: D1.2(A) SW_DbMA.2
NetD2_2: D2.2(A) SW_AbMA.2
NetD3_2: D3.2(A) SW_EbMA.2
NetD4_2: D4.2(A) SW_BbMA.2
NetD5_2: D5.2(A) SW_FMA.2
NetD6_2: D6.2(A) SW_CMA.2
NetD7_2: D7.2(A) SW_Dbmi.2
NetD8_2: D8.2(A) SW_Abmi.2
NetD9_2: D9.2(A) SW_Ebmi.2
NetD10_2: D10.2(A) SW_Bbmi.2
NetD11_2: D11.2(A) SW_Fmi.2
NetD12_2: D12.2(A) SW_Cmi.2
NetD13_2: D13.2(A) SW_Db7.2
NetD14_2: D14.2(A) SW_Ab7.2
NetD15_2: D15.2(A) SW_Eb7.2
NetD16_2: D16.2(A) SW_Bb7.2
NetD17_2: D17.2(A) SW_F7.2
NetD18_2: D18.2(A) SW_C7.2
NetD19_2: D19.2(A) SW_GMA.2
NetD20_2: D20.2(A) SW_DMA.2
NetD21_2: D21.2(A) SW_AMA.2
NetD22_2: D22.2(A) SW_EMA.2
NetD23_2: D23.2(A) SW_BMA.2
NetD24_2: D24.2(A) SW_FsMA.2
NetD25_2: D25.2(A) SW_Gmi.2
NetD26_2: D26.2(A) SW_Dmi.2
NetD27_2: D27.2(A) SW_Ami.2
NetD28_2: D28.2(A) SW_Emi.2
NetD29_2: D29.2(A) SW_Bmi.2
NetD30_2: D30.2(A) SW_Fsmi.2
NetD31_2: D31.2(A) SW_G7.2
NetD32_2: D32.2(A) SW_D7.2
NetD33_2: D33.2(A) SW_A7.2
NetD34_2: D34.2(A) SW_E7.2
NetD35_2: D35.2(A) SW_B7.2
NetD36_2: D36.2(A) SW_Fs7.2

### Notes on the sheet
- Button Matrix
- To read the matrix Drive one colum high and set the others as Hi-Z (inputs) then read the rows. Repeat for every column until the full matrix is read.
- There are many optons for switches that are compatable with Cherry MX switches. Make sure to get switches with the extra 'fixation pins' sometimes called '5 pin' switches.
- Title:
- This work is licensed under a Creative Commons Attribution 4.0 International License. Derivative works should remove all Sophistry branding and ‘é’ watermark.
- Date:
- Engineer:
- Revision:
- Codename:
- Time:
- Variant:
- Sheet
- of

### Library data of the parts
D1-D36 = 1N4148W-7-F: DIODE SWITCH 100V 0.15A SOD123; Manufacturer: Diodes Incorporated; Diode Type: Standard; Current - Average Rectified (Io): 150mA; Voltage - Forward (Vf) (Max) @ If: 1.25V @ 150mA; Speed: Small Signal =< 200mA (Io), Any Speed; Reverse Recovery Time (trr): 4ns; Current - Reverse Leakage @ Vr: 1µA @ 75V; Capacitance @ Vr, F: 2pF @ 0V, 1MHz; PartNumber: 1N4148W-7-F; Datasheets: http://www.diodes.com/datasheets/ds30086.pdf; Supplier 1: Digi-Key; Supplier Part Number 1: 1N4148W-FDICT-ND; Manufacturer Part Number: 1N4148W-7-F; Series: 0; Voltage - DC Reverse (Vr) (Max): 100V; Mounting Type: Surface Mount; Package / Case: SOD-123; Supplier Device Package: SOD-123; Operating Temperature - Junction: -65°C ~ 150°C
SW_A7 SW_Ab7 SW_AbMA SW_Abmi SW_AMA SW_Ami SW_B7 SW_Bb7 SW_BbMA SW_Bbmi SW_BMA SW_Bmi SW_C7 SW_CMA SW_Cmi SW_D7 SW_Db7 SW_DbMA SW_Dbmi SW_DMA SW_Dmi SW_E7 SW_Eb7 SW_EbMA SW_Ebmi SW_EMA SW_Emi SW_F7 SW_FMA SW_Fmi SW_Fs7 SW_FsMA SW_Fsmi SW_G7 SW_GMA SW_Gmi = MX1A-11NW: SWITCH PUSH SPST-NO 0.01A 12V; Manufacturer: Cherry Americas LLC; HelpURL: https://media.digikey.com/pdf/Data%20Sheets/Cherry%20PDFs/MX%20Series.pdf; Supplier 1: Digi-Key; Supplier Part Number 1: CH160-ND; Supplier 2: Mouser; Supplier Part Number 2: 540-MX1A-11NW; PartNumber: MX1A-11NW; Manufacturer Part Number: MX1A-11NW

## Nets that join several sheets
COLUMN_0: Logic (U1.11), Matrix (6 pins)
COLUMN_1: Logic (U1.12), Matrix (6 pins)
COLUMN_2: Logic (U1.14), Matrix (6 pins)
COLUMN_3: Logic (U1.15), Matrix (6 pins)
COLUMN_4: Logic (U1.16), Matrix (6 pins)
COLUMN_5: Logic (U1.17), Matrix (6 pins)
ROW_7TH_0: Logic (U1.4), Matrix (6 pins)
ROW_7TH_1: Logic (U1.5), Matrix (6 pins)
ROW_MAJ_0: Logic (U1.9), Matrix (6 pins)
ROW_MAJ_1: Logic (U1.10), Matrix (6 pins)
ROW_MIN_0: Logic (U1.6), Matrix (6 pins)
ROW_MIN_1: Logic (U1.7), Matrix (6 pins)